# Altium schematic sheet RemoteControlCC1101.SchDoc
size A4
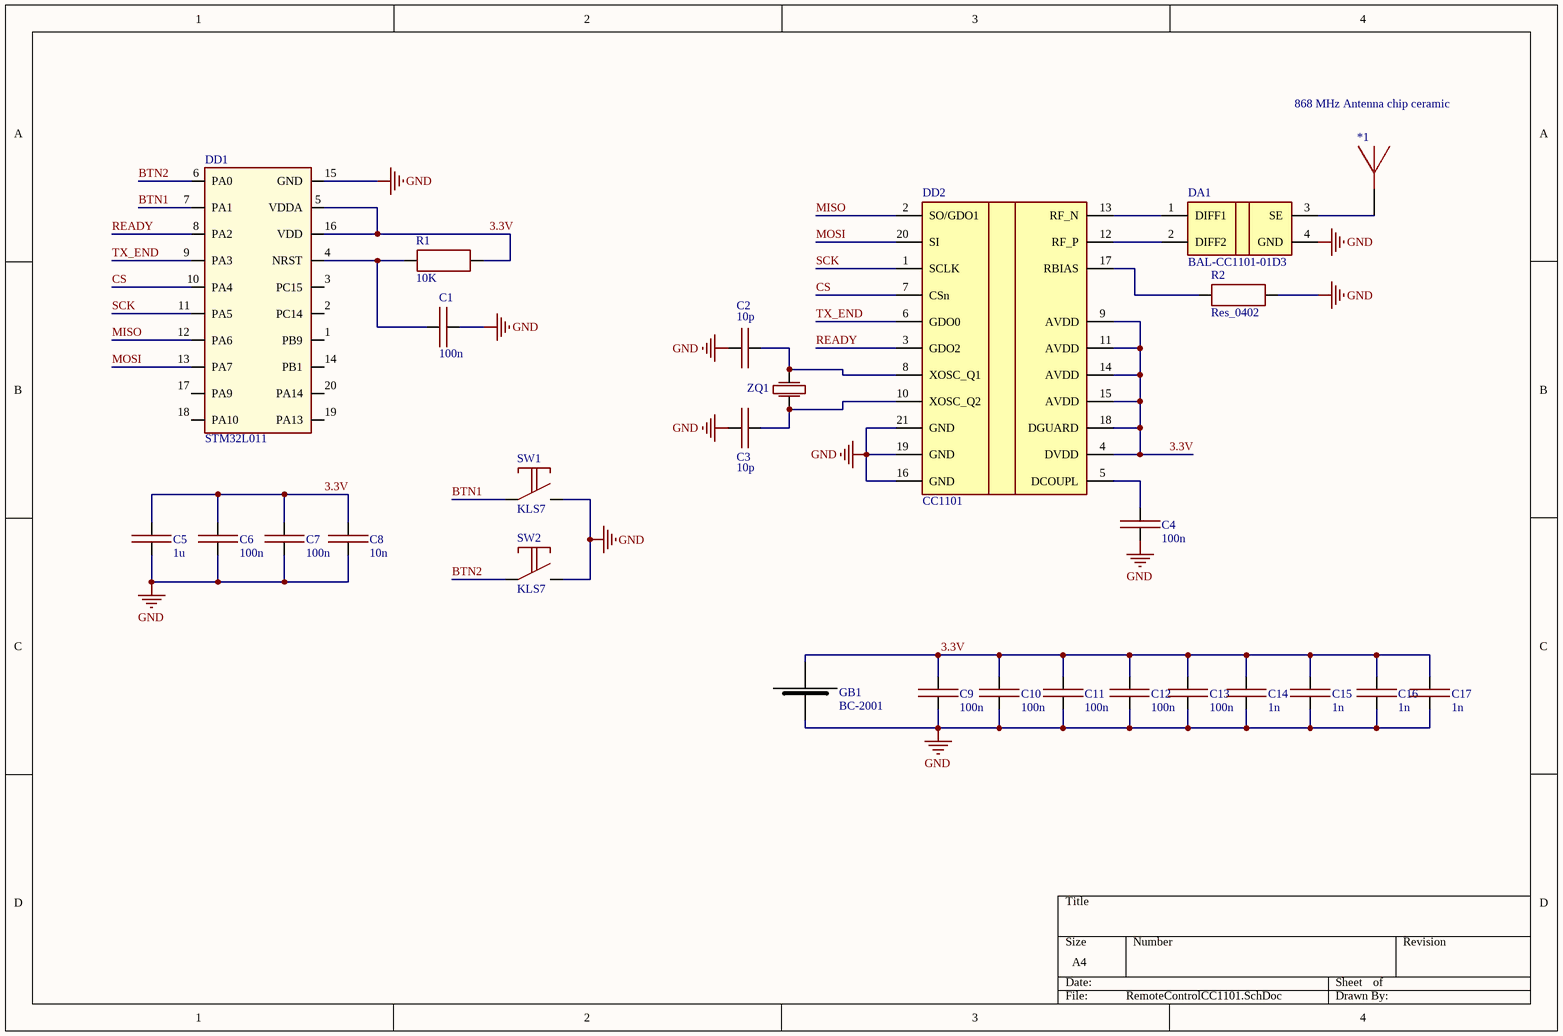
[diagram p0: RemoteControlCC1101.SchDoc]

## Parts
*1  868 MHz Antenna chip ceramic  [868_chip]
C1  100n  [C0402]
C2  10p  [C0402]
C3  10p  [C0402]
C4  100n  [C0402]
C5  1u  [C0603]
C6  100n  [C0402]
C7  100n  [C0402]
C8  10n  [C0402]
C9  100n  [C0402]
C10  100n  [C0402]
C11  100n  [C0402]
C12  100n  [C0402]
C13  100n  [C0402]
C14  1n  [C0402]
C15  1n  [C0402]
C16  1n  [C0402]
C17  1n  [C0402]
DA1  BAL-CC1101-01D3  [BGA4x2_BALLUN - duplicate]
DD1  STM32L011  [TSSOP20]
DD2  СС1101  [S-PVQFN-N20]
GB1  BC-2001  [BC-2001]
R1  10K  [R0402]
R2  Res_0402  [R0402]
SW1  KLS7-TS6604-4.3-180  [KLS7_6_6_4.3_SMD]  (value not drawn)
SW2  KLS7-TS6604-4.3-180  [KLS7_6_6_4.3_SMD]  (value not drawn)
ZQ1  ABM3B-8.000MHZ-10-1-U-T  [ABM3B]  (value not drawn)

## Nets
GND: C1.2 C2.1 C3.1 C4.1 C5.1 C6.2 C7.2 C8.2 C9.2 C10.2 C11.2 C12.2 C13.2 C14.2 C15.2 C16.2 C17.2 DA1.4(GND) DD1.15(GND) DD2.16(GND) DD2.19(GND) DD2.21(GND) GB1.2(-) R2.2 SW1.2 SW2.2 ZQ1.2 ZQ1.4
3.3V: C5.2 C6.1 C7.1 C8.1 C9.1 C10.1 C11.1 C12.1 C13.1 C14.1 C15.1 C16.1 C17.1 DD1.5(VDDA) DD1.16(VDD) DD2.4(DVDD) DD2.9(AVDD) DD2.11(AVDD) DD2.14(AVDD) DD2.15(AVDD) DD2.18(DGUARD) GB1.1(+) R1.2
BTN1: DD1.7(PA1) SW1.1
BTN2: DD1.6(PA0) SW2.1
CS: DD1.10(PA4) DD2.7(CSn)
MISO: DD1.12(PA6) DD2.2(SO/GDO1)
MOSI: DD1.13(PA7) DD2.20(SI)
READY: DD1.8(PA2) DD2.3(GDO2)
SCK: DD1.11(PA5) DD2.1(SCLK)
TX_END: DD1.9(PA3) DD2.6(GDO0)
Net*1_1: *1.1 DA1.3(SE)
NetC1_1: C1.1 DD1.4(NRST) R1.1
NetC2_2: C2.2 DD2.8(XOSC_Q1) ZQ1.3
NetC3_2: C3.2 DD2.10(XOSC_Q2) ZQ1.1
NetC4_2: C4.2 DD2.5(DCOUPL)
NetDA1_1: DA1.1(DIFF1) DD2.13(RF_N)
NetDA1_2: DA1.2(DIFF2) DD2.12(RF_P)
NetDD2_17: DD2.17(RBIAS) R2.1

Not connected (* = marked no-connect by the designer): DD1 1(PB9) 2(PC14) 3(PC15) 14(PB1) 17(PA9) 18(PA10) 19(PA13) 20(PA14)

## Notes on the sheet
- (in symbol KLS7-TS6604) KLS7

## Library data of the parts
C1-C4 C6-C17 = Cap_Ceramic_NPO_0402: Cap Ceramic, 0402, 5%, 50V, NPO (C0G), -55 +125C
C5 = Cap_Ceramic_X7R(X5R)_0603: Cap Ceramic, 0603, ±10%, 50V, X7R (X5R), -55 +125C (-55 +85C)
DA1 = BAL-CC1101-01D3: 50 ohm nominal input / conjugate match balun
DD1 = STM32L011: Access line ultra-low-power 32-bit MCU Arm®-based / Cortex®-M0+, up to 16KB Flash, 2KB SRAM, 512B EEPROM, ADC
DD2 = СС1101: Low-Power Sub-1 GHz RF Transceiver
GB1 = BC-2001: 2032 holder
R1 R2 = Res_0402: Res, 0402, 1%, 1/12W
SW1 SW2 = KLS7-TS6604: Tact Switch, 6x6x4.3mm, SMD
ZQ1 = ABM3B-8.000MHZ-10-1-U-T: QUARZ, 8МГц (Abracon)